# EAGLE schematic ESP32S3 Base Schematic v1 (EAGLE 9.7.0)
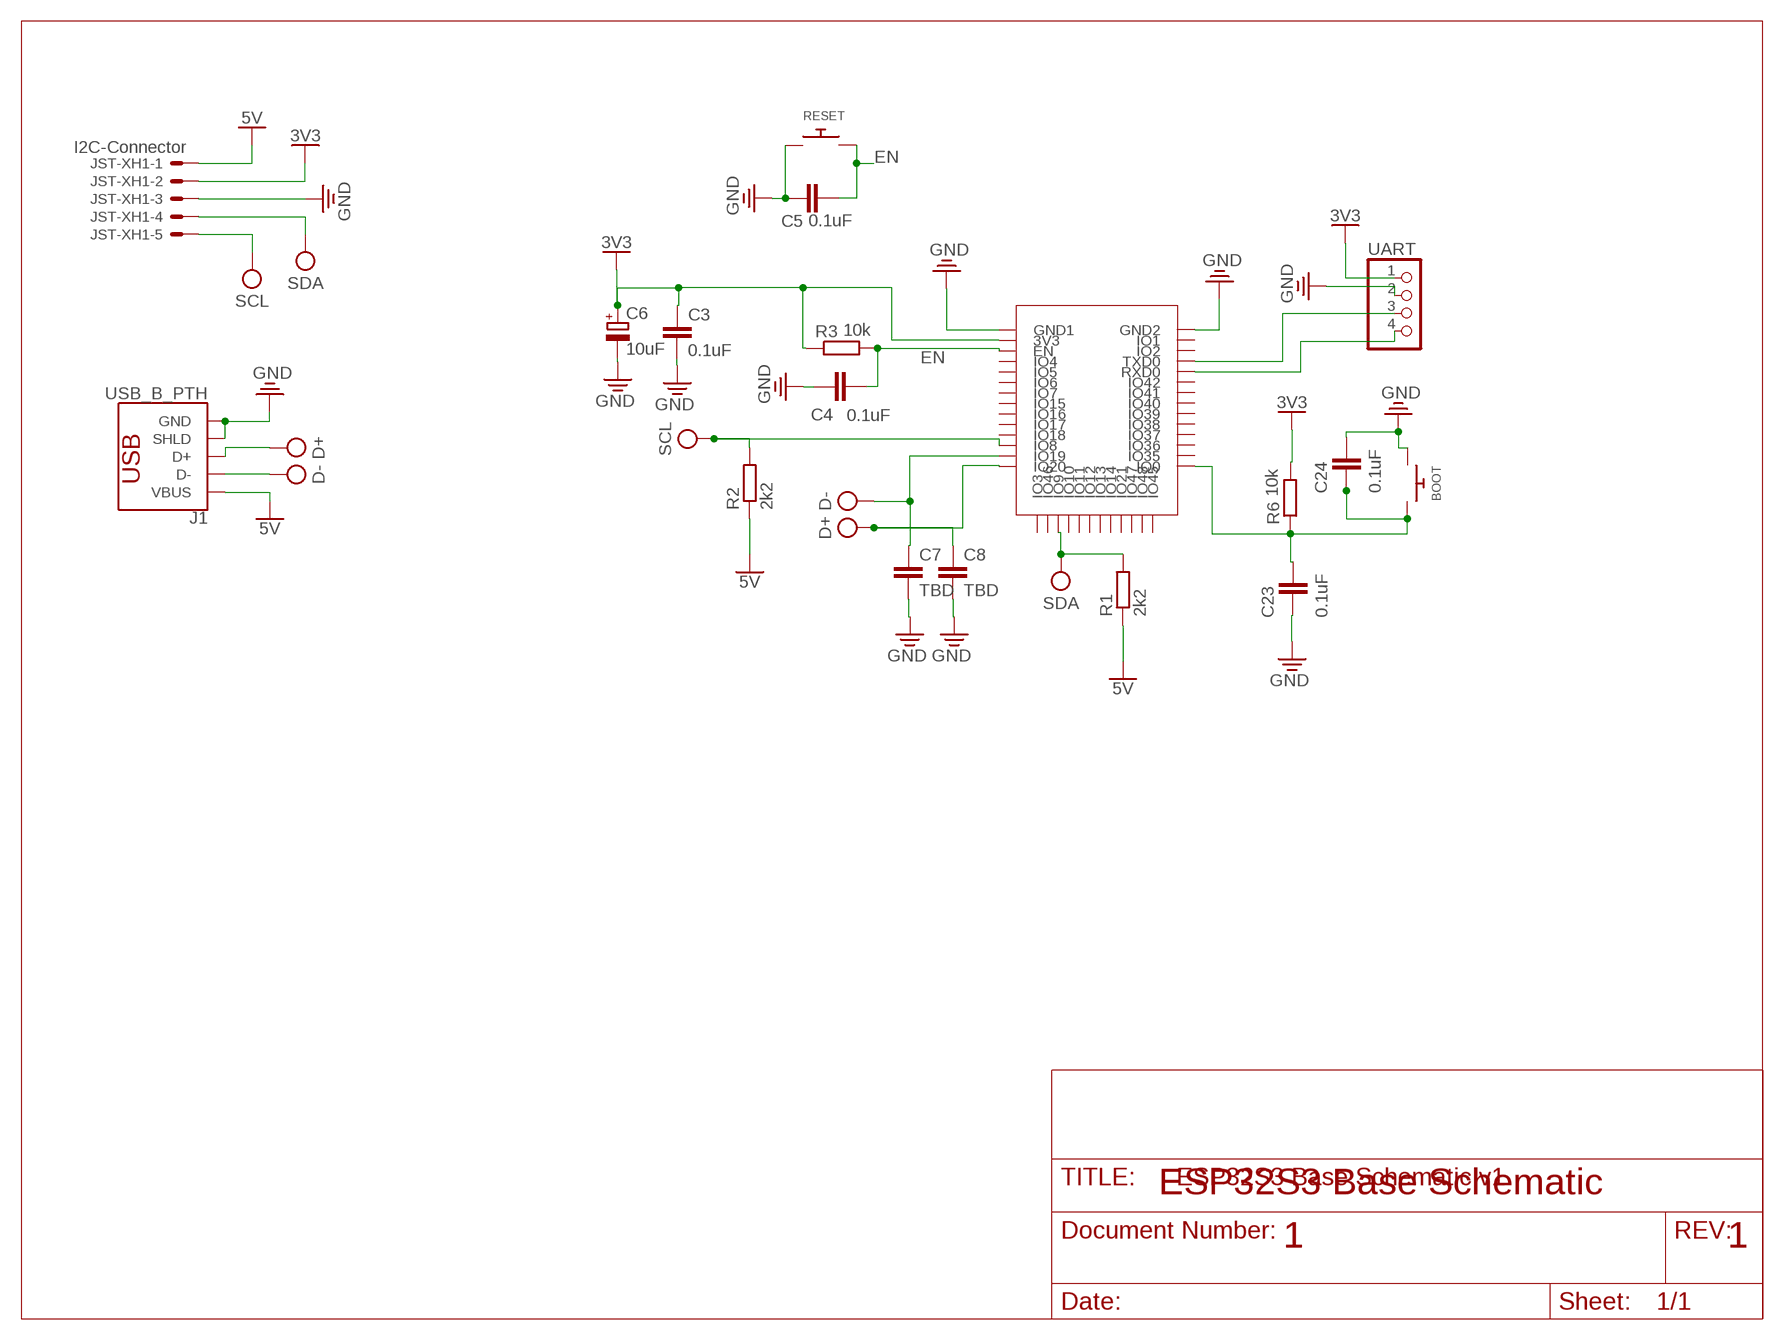
[diagram p0: schematic, sheet 1]

## Parts
BOOT  SWITCH_PUSHBUTTONEVQ-PE  [TACT_PANA-EVQ]
C3  0.1uF  C-EU025-030X050  [C025-030X050]
C4  0.1uF  C-EU025-030X050  [C025-030X050]
C5  0.1uF  C-EU025-030X050  [C025-030X050]
C6  10uF  C-POL_RADIAL-11MM-DIA  [CAPPRD508W65D1000H1100B]
C7  TBD  C-EU025-030X050  [C025-030X050]
C8  TBD  C-EU025-030X050  [C025-030X050]
C23  0.1uF  C-EU025-030X050  [C025-030X050]
C24  0.1uF  C-EU025-030X050  [C025-030X050]
J1  USB_B_PTH  [USB-B-PTH]
JST-XH1  I2C-Connector  JST-XH-05-PIN-LONG-PAD  [JST-XH-05-PACKAGE-LONG-PAD]
R1  2k2  R-EU_0204/5  [0204/5]
R2  2k2  R-EU_0204/5  [0204/5]
R3  10k  R-EU_0204/7  [0204/7]
R6  10k  R-EU_0204/7  [0204/7]
RESET  SWITCH_PUSHBUTTONEVQ-PE  [TACT_PANA-EVQ]
U$2  ESP32-S3-WROOM-1  [ESP32-S3-WROOM-1]
UART  PINHD-1X4  [1X04]

## Nets
3V3: C3.1 C6.1(+) JST-XH1.2 R3.1 R6.2 U$2.3V3 UART.1
5V: J1.VBUS JST-XH1.1 R1.1 R2.1
D+: C8.1 J1.D+ U$2.IO20
D-: C7.1 J1.D- U$2.IO19
EN: C4.2 C5.2 R3.2 RESET.P$2 U$2.EN
GND: BOOT.P$1 C3.2 C4.1 C5.1 C6.2(-) C7.2 C8.2 C23.1 C24.2 J1.GND J1.SHLD1(SHLD) J1.SHLD2(SHLD) JST-XH1.3 RESET.P$1 U$2.GND1 U$2.GND2 UART.2
N$1: U$2.TXD0 UART.3
N$2: U$2.RXD0 UART.4
N$9: BOOT.P$2 C23.2 C24.1 R6.1 U$2.IO0
SCL: JST-XH1.5 R2.2 U$2.IO8
SDA: JST-XH1.4 R1.2 U$2.IO9
Unconnected: U$2.IO1 U$2.IO2 U$2.IO3 U$2.IO4 U$2.IO5 U$2.IO6 U$2.IO7 U$2.IO10 U$2.IO11 U$2.IO12 U$2.IO13 U$2.IO14 U$2.IO15 U$2.IO16 U$2.IO17 U$2.IO18 U$2.IO21 U$2.IO35 U$2.IO36 U$2.IO37 U$2.IO38 U$2.IO39 U$2.IO40 U$2.IO41 U$2.IO42 U$2.IO45 U$2.IO46 U$2.IO47 U$2.IO48

## Notes on the sheet
- ESP32S3 Base Schematic
- 1 | 1

## Library data of the parts
BOOT RESET = adafruit:SWITCH_PUSHBUTTON: Buttons SOFTTOUCHSMD_SJ - Soft touch temporary push button (Super Junk Akihabara) Compatible with SKPMANE010 [Mouser: 688-SKPMAN] C&K_KSS = Digikey: KSS221GLFS
C3-C5 C7 C8 C23 C24 = rcl:C-EU: CAPACITOR, European symbol; SPICEPREFIX: C
C6 = Capacitor:C-POL: Capacitor Polarised - Generic; CATEGORY: Capacitor
J1 = SparkFun-Connectors:USB_B: USB Type B Connector SparkFun Products: SparkFun Stepoko <https://www.sparkfun.com/products/13899> PTH; PROD_ID: CONN-08278; SF_ID: PRT-00139
JST-XH1 = Rembrandt Electronics - JST XH Connectors v1-0:JST-XH-05-PIN: JST XH Connector 2 Pin Wire to board connector. Pitch: 2,54 mm, (0.100") Number of pins: 5 Created by Rembrandt Electronics www.rembrandtelectronics.com
R1-R3 R6 = rcl:R-EU_: RESISTOR, European symbol; SPICEPREFIX: R
U$2 = RobotMower_Eagle_Library:ESP32-S3-WROOM-1
UART = Connector:PINHD-1X4: PIN HEADER; CATEGORY: Headers; DESCRIPTION: Header, Straight, 4 Position; MANUFACTURER: Generic; MPN: Generic; OPERATING_TEMPERATURE: Generic; PART_STATUS: Active; PITCH: 0.100" (2.54mm); ROHS_COMPLIANCE: Generic; SERIES: Generic; SUB-CATEGORY: Headers, Male Pins; TYPE: Board to Board or Cable, Unshrouded, Through Hole, Straight